# EAGLE schematic PoElli-RasPi-mechanics (EAGLE 6.5.2)
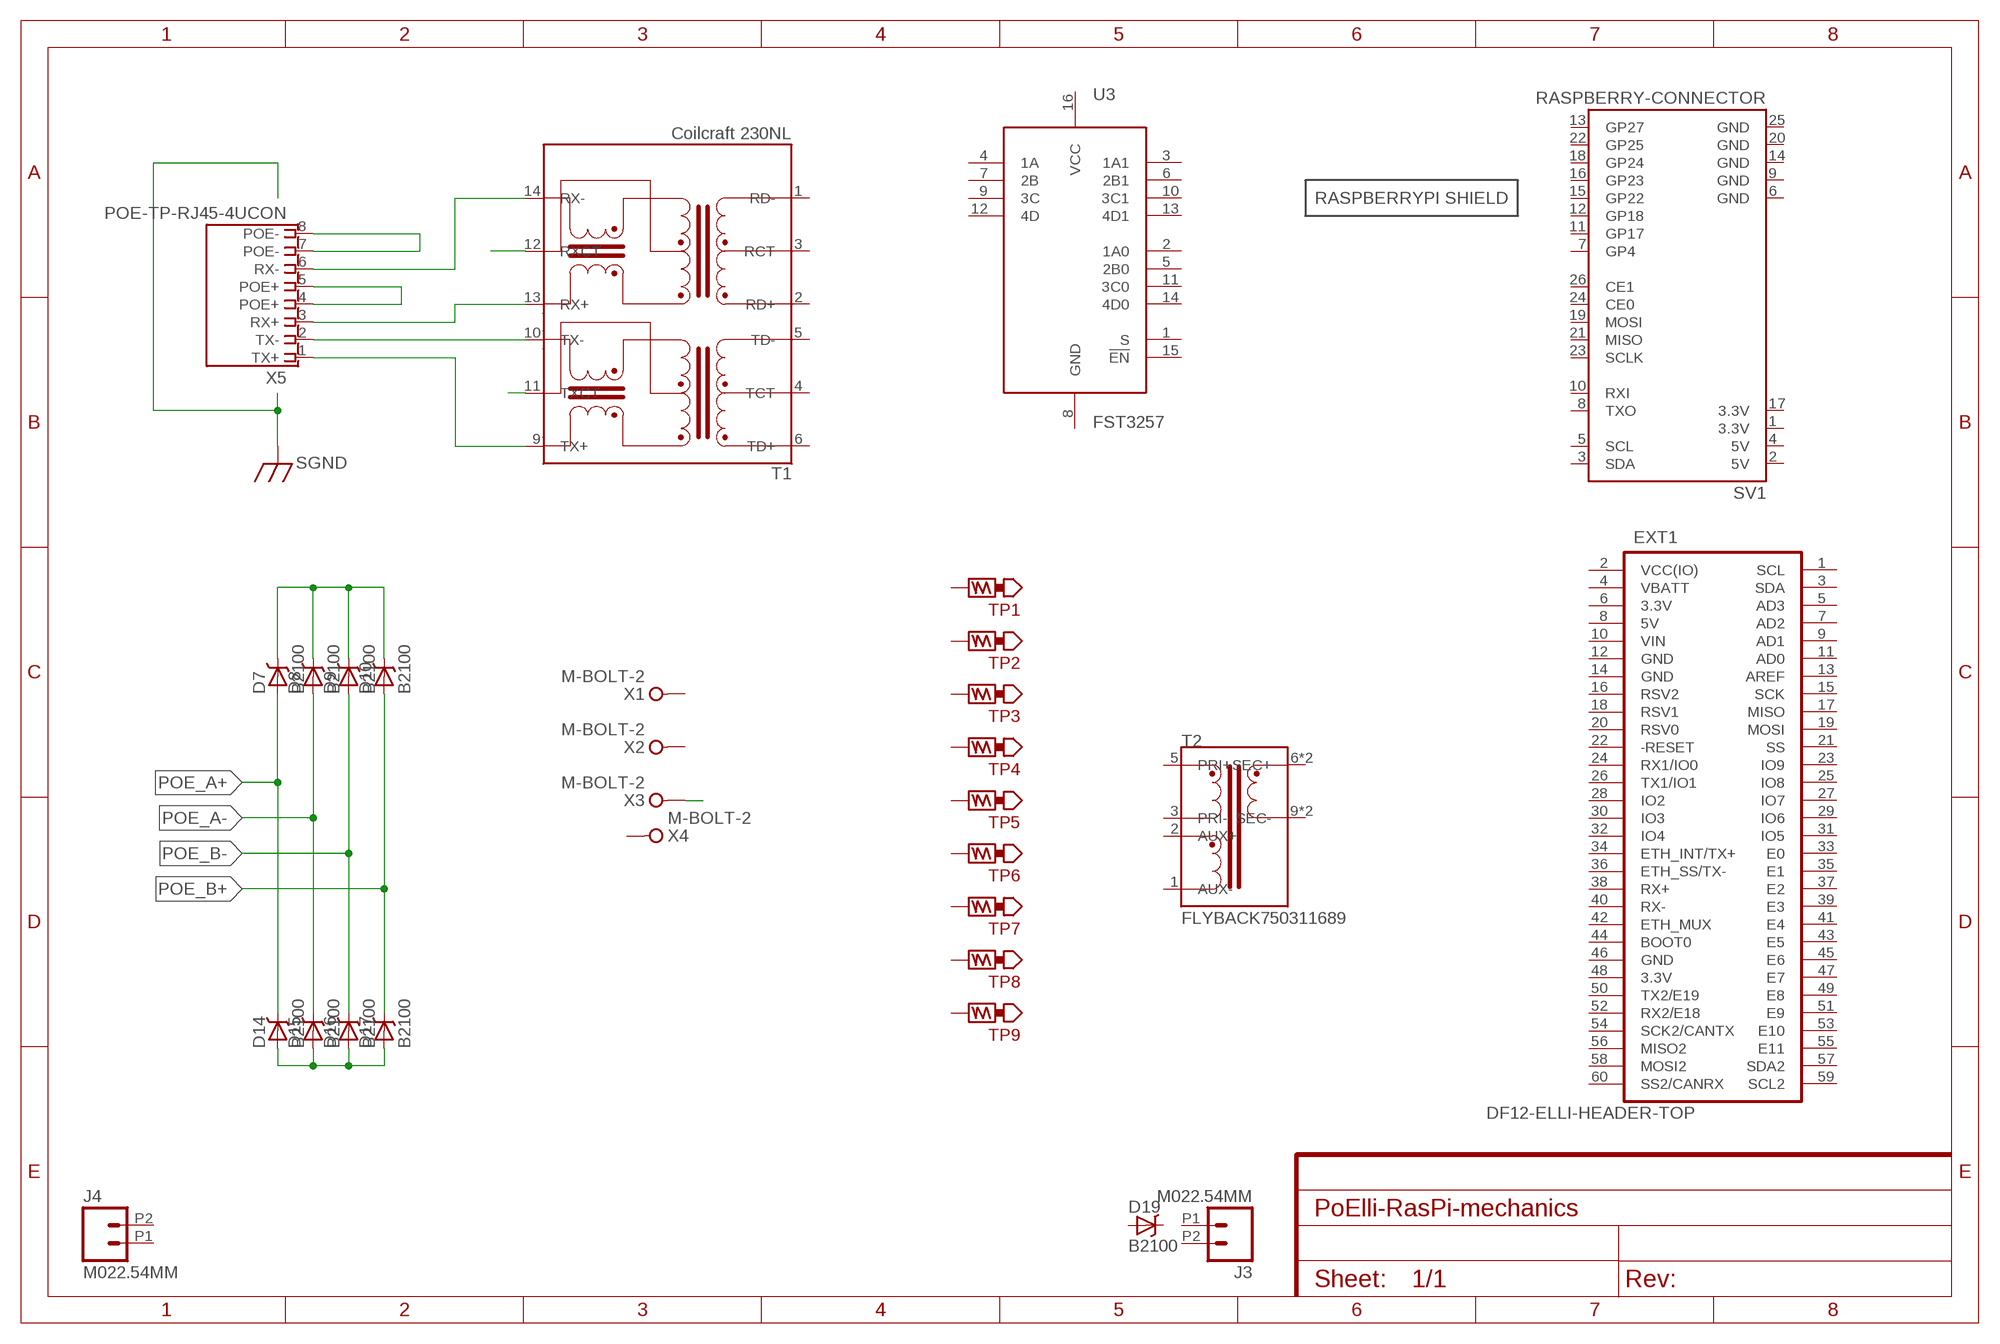
[diagram p0: schematic, sheet 1]

## Parts
D7  B2100  DIODE-SCHOTTKYB2100  [DIODE-B2100]
D8  B2100  DIODE-SCHOTTKYB2100  [DIODE-B2100]
D9  B2100  DIODE-SCHOTTKYB2100  [DIODE-B2100]
D10  B2100  DIODE-SCHOTTKYB2100  [DIODE-B2100]
D14  B2100  DIODE-SCHOTTKYB2100  [DIODE-B2100]
D15  B2100  DIODE-SCHOTTKYB2100  [DIODE-B2100]
D16  B2100  DIODE-SCHOTTKYB2100  [DIODE-B2100]
D17  B2100  DIODE-SCHOTTKYB2100  [DIODE-B2100]
D19  B2100  DIODE-SCHOTTKYB2100  [DIODE-B2100]
EXT1  DF12-ELLI-HEADER-TOP  [DF12(4.0)-60DP-0.5V]
J3  M022.54MM  M022.54MM_SCREWTERM  [1X02_2.54_SCREWTERM]
J4  M022.54MM  M022.54MM_SCREWTERM  [1X02_2.54_SCREWTERM]
OUTLINE1  RASPBERRY-OUTLINE  [RASPBERRYPI-SHIELD-OUTLINE]
SV1  RASPBERRY-CONNECTOR  [RASPBERRYPI-SHIELD-CONNECTOR]
T1  Coilcraft 230NL  POE-ISOLATION-230NL  [COILCRAFT-ETH1-230L]
T2  FLYBACK750311689  [WE_EP13_SMD_10PIN]
TP1  TEST_POINT-5000  [TP_5021]
TP2  TEST_POINT-5021  [TP_5000]
TP3  TEST_POINT-5021  [TP_5000]
TP4  TEST_POINT-5021  [TP_5000]
TP5  TEST_POINT-5000  [TP_5021]
TP6  TEST_POINT-5000  [TP_5021]
TP7  TEST_POINT-5000  [TP_5021]
TP8  TEST_POINT-5000  [TP_5021]
TP9  TEST_POINT-5000  [TP_5021]
U3  FST3257  [SOIC-16-NARROW]
X1  M-BOLT-2  [M2-1]
X2  M-BOLT-2  [M2-1]
X3  M-BOLT-2  [M2-1]
X4  M-BOLT-2  [M2-1]
X5  POE-TP-RJ45-4UCON  [4UCON-04892]

## Nets
N$1: T1.10(TX-) X5.2(TX-)
N$2: T1.9(TX+) X5.1(TX+)
N$3: T1.13(RX+) X5.3(RX+)
N$4: T1.14(RX-) X5.6(RX-)
N$6: D7.C D8.C D9.C D10.C
N$8: D14.A D15.A D16.A D17.A
N$10: X5.7(POE-) X5.8(POE-)
N$13: T1.11(TXCT)
N$21: X3.1(KL1)
POE_A+: D7.A D14.C
POE_A-: D8.A D15.C T1.12(RXCT)
POE_B+: D10.A D17.C X5.4(POE+) X5.5(POE+)
POE_B-: D9.A D16.C
Unconnected: D19.A D19.C EXT1.1(SCL) EXT1.3(SDA) EXT1.5(AD3) EXT1.7(AD2) EXT1.9(AD1) EXT1.11(AD0) EXT1.13(AREF) EXT1.15(SCK) EXT1.16(RSV2) EXT1.17(MISO) EXT1.18(RSV1) EXT1.19(MOSI) EXT1.20(RSV0) EXT1.21(SS) EXT1.22(-RESET) EXT1.23(IO9) EXT1.24(RX1/IO0) EXT1.25(IO8) EXT1.26(TX1/IO1) EXT1.27(IO7) EXT1.28(IO2) EXT1.29(IO6) EXT1.30(IO3) EXT1.31(IO5) EXT1.32(IO4) EXT1.33(E0) EXT1.34(ETH_INT/TX+) EXT1.35(E1) EXT1.36(ETH_SS/TX-) EXT1.37(E2) EXT1.38(RX+) EXT1.39(E3) EXT1.40(RX-) EXT1.41(E4) EXT1.42(ETH_MUX) EXT1.43(E5) EXT1.44(BOOT0) EXT1.45(E6) EXT1.46(GND) EXT1.47(E7) EXT1.48(3.3V) EXT1.49(E8) EXT1.50(TX2/E19) EXT1.51(E9) EXT1.52(RX2/E18) EXT1.53(E10) EXT1.54(SCK2/CANTX) EXT1.55(E11) EXT1.56(MISO2) EXT1.57(SDA2) EXT1.58(MOSI2) EXT1.59(SCL2) EXT1.60(SS2/CANRX) J3.P1 J3.P2 J4.P1 J4.P2 SV1.3(SDA) SV1.5(SCL) SV1.7(GP4) SV1.8(TXO) SV1.10(RXI) SV1.11(GP17) SV1.12(GP18) SV1.13(GP27) SV1.15(GP22) SV1.16(GP23) SV1.18(GP24) SV1.19(MOSI) SV1.21(MISO) SV1.22(GP25) SV1.23(SCLK) SV1.24(CE0) SV1.26(CE1) T1.1(RD-) T1.2(RD+) T1.3(RCT) T1.4(TCT) T1.5(TD-) T1.6(TD+) T2.1(AUX-) T2.2(AUX+) T2.3(PRI-) T2.5(PRI+) T2.6(SEC+) T2.7(SEC+) T2.9(SEC-) T2.10(SEC-) TP1.P$1 TP2.P$1 TP3.P$1 TP4.P$1 TP5.P$1 TP6.P$1 TP7.P$1 TP8.P$1 TP9.P$1 U3.1(S) U3.2(1A0) U3.3(1A1) U3.4(1A) U3.5(2B0) U3.6(2B1) U3.7(2B) U3.9(3C) U3.10(3C1) U3.11(3C0) U3.12(4D) U3.13(4D1) U3.14(4D0) U3.15(!EN) X1.1(KL1) X2.1(KL1) X4.1(KL1)

## Power pins joined to a net without a drawn wire
3.3V: EXT1.6(3.3V) SV1.1(3.3V) SV1.17(3.3V)
5V: EXT1.8(5V) SV1.2(5V) SV1.4(5V)
GND: EXT1.12(GND) EXT1.14(GND) SV1.6(GND) SV1.9(GND) SV1.14(GND) SV1.20(GND) SV1.25(GND) U3.8(GND)
VBATT: EXT1.4(VBATT)
VCC: U3.16(VCC)
VCC(IO): EXT1.2(VCC(IO))
VIN: EXT1.10(VIN)

## Library data of the parts
D7-D10 D14-D17 D19 = ELL-i-DIscreteSemi:DIODE-SCHOTTKY: Schottky Diodes A Schottky diode has a low forward voltage drop and a very fast switching action. A normal silicon diode has a voltage drop between 0.6–0.7 volts, while a Schottky diode voltage drop is between approximately 0.15–0.45 volts. This lower voltage drop can provide higher switching speed and better system efficiency. Wikipedia article on Schottky diodes <https://en.wikipedia.org/wiki/Schottky_diode>
EXT1 = ELL-i-Connectors:DF12-ELLI-*
J3 J4 = SparkFun-Connectors:M02: Standard 2-pin 0.1" header. Use with - straight break away headers ( PRT-00116) - right angle break away headers (PRT-00553) - swiss pins (PRT-00743) - machine pins (PRT-00117) - female headers (PRT-00115) Molex polarized connector foot print use with: PRT-08233 with associated crimp pins and housings. 2.54_SCREWTERM for use with PRT-10571. 3.5mm Screw Terminal footprints for PRT-08084 5mm Screw Terminal footprints for use with PRT-08433
OUTLINE1 = ELL-i-Boards:RASPBERRY-OUTLINE
SV1 = ELL-i-Boards:RASPBERRY-CONNECTOR
T1 = ELL-i-Transformers:POE-ISOLATION: Power-over-Ethernet isolation transformers In twisted pair Ethernet networks, there is a 1500V isolation transformer between the network cable and the connected device. In Power-over-Ethernet devices, the transformer provides the extra function of allowing the DC power to be extracted from the cable-side center taps of the transformer. For high-power PoE, the transformer cable-side winding must be of thick enough wire (i.e. have low-enough resistance) to carry the DC current without warming up too much. Isolation transformers <https://en.wikipedia.org/wiki/Isolation_transformer> (general article) Power-over-Ethernet <https://en.wikipedia.org/wiki/Power_over_Ethernet> (general article)
T2 = ELL-i-Transformers:FLYBACK: Flyback SMPS transformer These types of transformers are often used in flyback and forward SMPS converters. The primary-side auxillary winding typically used to generate a 7-12 V auxillary voltage, which is used to generate the operating voltage (VCC) for the SMPS controller chip. The packages includes the ones used at various ELL-i boards.
TP1-TP9 = ELL-i-Passives:TEST_POINT: Used for easier attachment of measuring equipment. Has both test loops and bare copper area.
U3 = ELL-i-DigitalIC:FST3257: Quad 2:1 Multiplexer / Demultiplexer Bus Switch
X1-X4 = ELL-i-Connectors:M-BOLT: Metric bolt connector
X5 = ELL-i-Connectors:POE-TP: Twisted pair Power-over-Ethernet MDI connector This is an 8-pin female twisted pair Ethernet <https://en.wikipedia.org/wiki/Ethernet_over_twisted_pair> jack, either an RJ45 jack <https://en.wikipedia.org/wiki/Registered_jack#RJ45> or an TIA/EIA-568 <https://en.wikipedia.org/wiki/TIA/EIA-568-B> punchdown jack. These connector are common for Cat5, Cat5e, and Cat6 Ethernet cables. In the used symbol, the TX and RX pins are named according to the medium dependent interface <https://en.wikipedia.org/wiki/Medium_dependent_interface> or computer (non-switch) side order, i.e. transmit on pins 1 and 2 on pair 3 (green in T568A or orange in T568B) and receive on pins 3 and 6 on pair 2 (orange in T568A and green in T568B), and extra pairs according to the Power-over-Ethernet <https://en.wikipedia.org/wiki/Power_over_Ethernet> Mode B specification, i.e. pins 4–5 (pair 1) and 7–8 (pair 4) forming the sides of the 48V DC. Hence, this symbol has 6 pin names while having 8 pins: TX+, TX-, RX+, RX-, POE+ and POE-, where the POE+ and POE- may be reversed at the network side, always requiring a diode bridge. Please note that neither T568A nor T568B are de facto standards for residential or commercial data wiring. It is a choice the company terminating the wire makes. Most people use A as it is easier to remember. In terms of data integrity (does the data arrive without loss ) there is no difference between the two wiring standards. You select one wiring standard and maintain it. As long as you have a straight through jumper data will be transmitted without errors. The ELL-i recommendation is to use T568A.